# Altium schematic sheet Forward Active Supply.SchDoc
size A
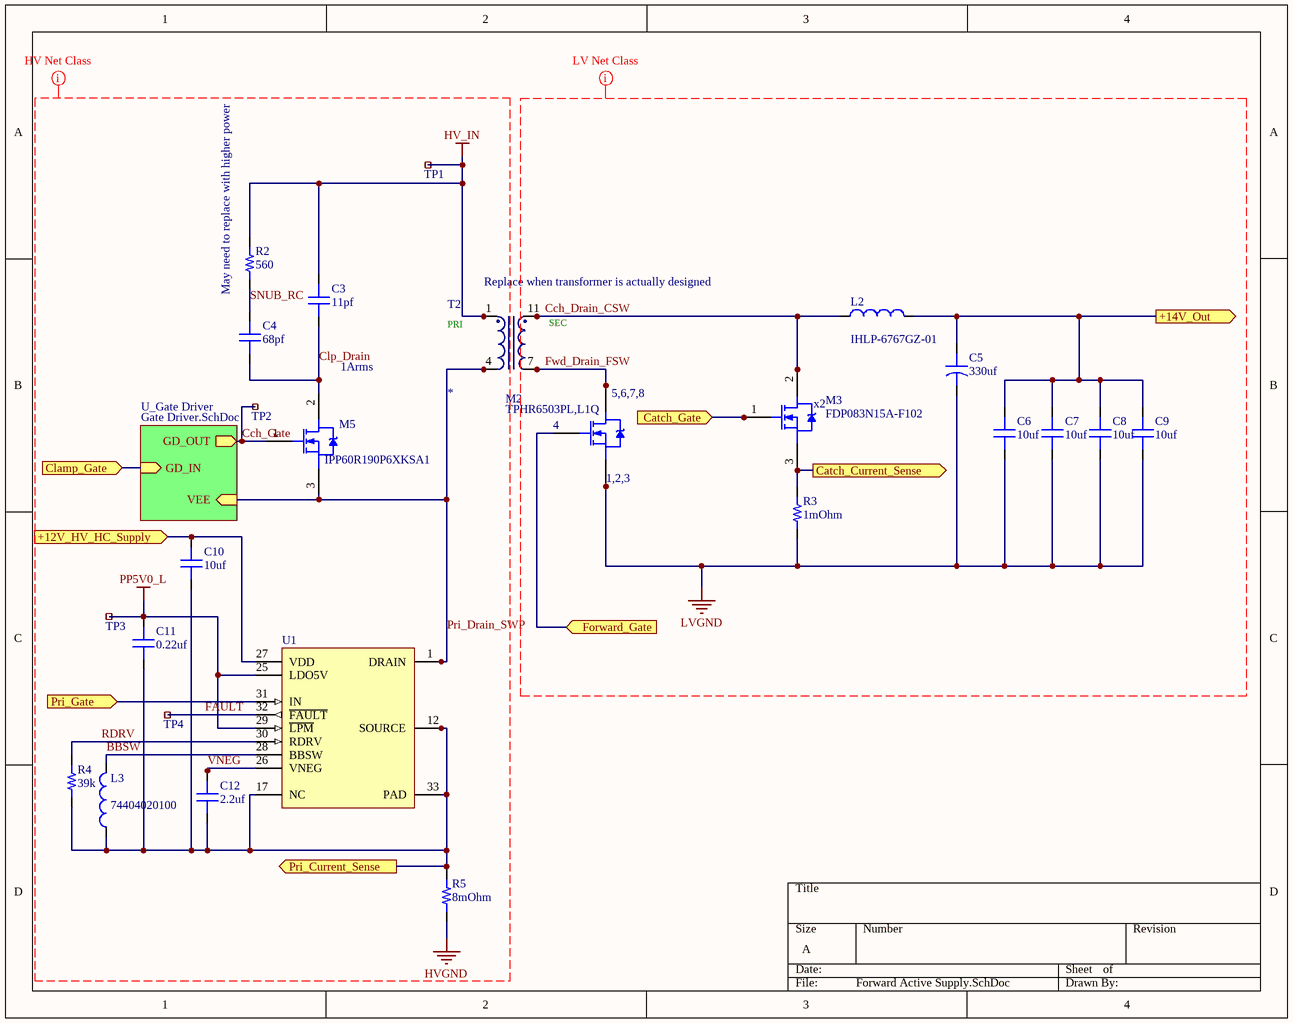
[diagram p0: Forward Active Supply.SchDoc]

## Parts
C3  value 11pf  [CAP 0805/2012]  (hidden comment: Capacitor MLCC 11pf 250V CAP 0805/2012)
C4  value 68pf  [CAP 0805/2012]  (hidden comment: Capacitor MLCC 68pf 200V CAP 0805/2012)
C5  value 330uf  [CAP ALUM 8.3MM]  (hidden comment: Capacitor Aluminum Hybrid Radial 330uf 25V CAP EL 8.3)
C6  value 10uf  [CAP 1206/3216 - 1.8MM]  (hidden comment: Capacitor MLCC 10uf 25V CAP 1206/3216)
C7  value 10uf  [CAP 1206/3216 - 1.8MM]  (hidden comment: Capacitor MLCC 10uf 25V CAP 1206/3216)
C8  value 10uf  [CAP 1206/3216 - 1.8MM]  (hidden comment: Capacitor MLCC 10uf 25V CAP 1206/3216)
C9  value 10uf  [CAP 1206/3216 - 1.8MM]  (hidden comment: Capacitor MLCC 10uf 25V CAP 1206/3216)
C10  value 10uf  [CAP 0603/1608]  (hidden comment: Capacitor MLCC 10uf 16V CAP 0603/1608)
C11  value 0.22uf  [CAP 0603/1608]  (hidden comment: Capacitor MLCC 0.22uf 50V CAP 0603/1608)
C12  value 2.2uf  [CAP 0603/1608]  (hidden comment: Capacitor MLCC 2.2uf 25V CAP 0603/1608)
L2  MfrPartNo: IHLP-6767GZ-01  [IHLP-6767GZ]
L3  (no value)  [74404020100]
M2  MfrPartNo: TPHR6503PL,L1Q  [SOP Advance]  (hidden comment: Forward Mosfet)
M3  MfrPartNo: FDP083N15A-F102  [TO-220ABx2]  (hidden comment: Catch Mosfet x2)
M5  MfrPartNo: IPP60R190P6XKSA1  [IPP60R190P6]  (hidden comment: Clamp Transistor)
R2  value 560  [RES 1206/3216]  (hidden comment: RES 560 OHM 1% 1W 1206)
R3  value 1mOhm  [RES 2010/5025]  (hidden comment: RES 0.001 OHM 1% 1.5W 2010)
R4  value 39k  [RES 0603/1608]  (hidden comment: Resistor 39k 0603 1/10W 1%)
R5  value 8mOhm  [RES 1206/3216]  (hidden comment: RES 0.008 OHM 1% 1W 1206)
T2  (no value)  [B66359]
TP1  RCU-0C  [5029]  (value not drawn)
TP2  RCU-0C  [5029]  (value not drawn)
TP3  RCU-0C  [5029]  (value not drawn)
TP4  RCU-0C  [5029]  (value not drawn)
U1  (no value)  [RWH0032A]

## Sub-sheets
U_Gate Driver = Gate Driver.SchDoc: GD_IN (in), VEE (in), GD_OUT (out)

## Ports
+12V_HV_HC_Supply (in), +14V_Out (out), Catch_Current_Sense (out), Catch_Gate (in), Clamp_Gate (in), Forward_Gate (in), Pri_Current_Sense (out), Pri_Gate (in)

## Nets
HV_IN: C3.2 R2.2 T2.1 T2.2 T2.3 TP1.1
HVGND: R5.1
LVGND: C5.2 C6.1 C7.1 C8.1 C9.1 M2.1(S) M2.2(S) M2.3(S) R3.1
PP5V0_L: C11.2 TP3.1 U1.25(LDO5V) U1.29(~{LPM})
+12V_HV_HC_Supply: C10.2 U1.27(VDD) ; port +12V_HV_HC_Supply
+14V_Out: C5.1 C6.2 C7.2 C8.2 C9.2 L2.2 ; port +14V_Out
BBSW: L3.2 U1.28(BBSW)
Catch_Current_Sense: M3.3(S) M3.6(S) R3.2 ; port Catch_Current_Sense
Catch_Gate: M3.1(G) M3.4(G) ; port Catch_Gate
Cch_Drain_CSW: L2.1 M3.2(D) M3.5(D) T2.11 T2.12 T2.13
Cch_Gate: M5.1(G) TP2.1 ; sheet U_Gate Driver/GD_OUT
Clamp_Gate: port Clamp_Gate, sheet U_Gate Driver/GD_IN
Clp_Drain: C3.1 C4.1 M5.2(D)
FAULT: TP4.1 U1.32(~{FAULT})
Forward_Gate: M2.4(G) ; port Forward_Gate
Fwd_Drain_FSW: M2.5(D) M2.6(D) M2.7(D) M2.8(D) T2.7 T2.8 T2.9 T2.10
Pri_Current_Sense: C10.1 C11.1 C12.2 L3.1 R4.1 R5.2 U1.12(SOURCE) U1.13(SOURCE) U1.14(SOURCE) U1.15(SOURCE) U1.16(SOURCE) U1.17(NC) U1.18(SOURCE) U1.19(SOURCE) U1.20(SOURCE) U1.21(SOURCE) U1.22(SOURCE) U1.23(SOURCE) U1.24(SOURCE) U1.33(PAD) ; port Pri_Current_Sense
Pri_Drain_SWP: M5.3(S) T2.4 T2.5 T2.6 U1.1(DRAIN) U1.2(DRAIN) U1.3(DRAIN) U1.4(DRAIN) U1.5(DRAIN) U1.6(DRAIN) U1.7(DRAIN) U1.8(DRAIN) U1.9(DRAIN) U1.10(DRAIN) U1.11(DRAIN) ; sheet U_Gate Driver/VEE
Pri_Gate: U1.31(IN) ; port Pri_Gate
RDRV: R4.2 U1.30(RDRV)
SNUB_RC: C4.2 R2.1
VNEG: C12.1 U1.26(VNEG)

## Layout directives
net class HV: BBSW, Cch_Gate, Clp_Drain, FAULT, HV_IN, HVGND, PP5V0_L, Pri_Drain_SWP, RDRV, SNUB_RC, VNEG
net class LV: Cch_Drain_CSW, Fwd_Drain_FSW, LVGND

## Notes on the sheet
- (near R2) May need to replace with higher power
- (near T2) Replace when transformer is actually designed
- 1Arms
- (in symbol 3) PRI; SEC
- (in symbol 18) 5,6,7,8; 1,2,3
- (in symbol 22) x2

## Library data of the parts
C3 = 1086: Manufacturer_id: 1; idCapacitor: 1086; Name: Cap_11pf_200V_CAP 0805/2012; Dielectric: Ceramic; Tolerance: 2%; Created_By: Nick Mah; Drawer_id: 1; Voltage_Rating: 250V; Package: CAP 0805/2012; ComponentLink1Description: Datasheet
C4 = 1085: Manufacturer_id: 1; idCapacitor: 1085; Name: Cap_68pf_200V_CAP 0805/2012; Dielectric: Ceramic; Tolerance: 5%; Created_By: Nick Mah; Drawer_id: 1; Voltage_Rating: 200V; Package: CAP 0805/2012; ComponentLink1Description: Datasheet
C5 = 1087: Null; Manufacturer_id: 1; MfrPartNo: EEH-ZA1E221P; idCapacitor: 1087; Name: Cap_330uf_25V_CAP EL 8.3; Tolerance: 20%; ESR: 0.027; Created_By: Jason Zhou; Supplier 1: Digi-Key; Supplier Part Number 1: P15437CT-ND; Drawer_id: 1; Voltage_Rating: 25V; Dielectric: Hybrid; Package: EL 8.3; Link: https://www.digikey.com/product-detail/en/panasonic-electronic-components/EEH-ZA1E221P/P15437CT-ND/3088149; ComponentLink1Description: Datasheet; Created_Date: 4/10/2019; ComponentLink1URL: https://industrial.panasonic.com/cdbs/www-data/pdf/RDD0000/ABA0000C1221.pdf; Updated_By: Jason Zhou; Updated_Date: 4/22/2019
C6-C9 = 1088: Manufacturer_id: 1; MfrPartNo: C3216X7R1E106K160AB; idCapacitor: 1088; Name: Cap_10uf_25V_CAP 1206/3216; Dielectric: Ceramic; Tolerance: 10%; Created_By: Jason Zhou; Drawer_id: 1; Voltage_Rating: 25V; Package: CAP 1206/3216; Link: https://www.digikey.com/product-detail/en/tdk-corporation/C3216X7R1E106K160AB/445-7705-1-ND/2733777; ComponentLink1Description: Datasheet; Created_Date: 4/10/2019; Supplier 1: Digi-Key; Supplier Part Number 1: 445-7705-1-ND; ComponentLink1URL: https://product.tdk.com/info/en/catalog/datasheets/mlcc_commercial_general_en.pdf
C10 = 235: Manufacturer_id: 1; idCapacitor: 235; Name: Cap_10uf_16V_CAP 0603/1608; Dielectric: Ceramic; Created_By: Nick Mah; Drawer_id: 1; Voltage_Rating: 16V; Package: CAP 0603/1608; Created_Date: 10/20/2018
C11 = 945: Manufacturer_id: 1; idCapacitor: 945; Name: Cap_0.22uf_50V_CAP 0603/1608; Dielectric: Ceramic; Created_By: Nick Mah; Drawer_id: 1; Voltage_Rating: 50V; Package: CAP 0603/1608; Created_Date: 10/20/2018
C12 = 591: Manufacturer_id: 1; idCapacitor: 591; Name: Cap_2.2uf_25V_CAP 0603/1608; Dielectric: Ceramic; Created_By: Nick Mah; Drawer_id: 1; Voltage_Rating: 25V; Package: CAP 0603/1608; Created_Date: 10/20/2018
L2 = 8: 1.5µH Shielded Molded Inductor 42A 1.88mOhm Max Nonstandard; Manufacturer_id: 1; idInductor: 8; Value: 1.5uH; Tolerance: 20%; Created_By: Jason Zhou; Drawer_id: 1; Name: IHLP-6767GZ-01; Current_Rating: 42A; DC_Resistance: 1.88mOhm; Package: Nonstandard; Link: https://www.digikey.com/product-detail/en/vishay-dale/IHLP6767GZER1R5M01/541-1251-1-ND/2025141; ComponentLink1Description: Datasheet; ComponentLink1URL: http://www.vishay.com/docs/34000/ihlp-6767gz-01.pdf; Supplier1: Digi-Key; Supplier1PartNo: 541-1251-1-ND; Created_Date: 4/22/2019
L3 = 7: 10µH Shielded Wirewound Inductor 500mA 850mOhm Nonstandard; Manufacturer_id: 1; idInductor: 7; Value: 10uH; Current_Rating: 0.5A; Tolerance: 20%; SRF: 39MHz; Created_By: Jason Zhou; MfrPartNo: 74404020100; Drawer_id: 1; Name: 74404020100; DC_Resistance: 850mOhm; Package: Nonstandard; Link: https://www.digikey.com/product-detail/en/wurth-electronics-inc/74404020100/732-10745-1-ND/6598179; ComponentLink1Description: Datasheet; ComponentLink1URL: https://katalog.we-online.de/pbs/datasheet/74404020100.pdf; Supplier1: Digi-Key; Supplier1PartNo: 732-10745-1-ND; Created_Date: 4/18/2019
M2 = 18: N-Channel 30V 150A (Tc) 960mW (Ta), 170W (Tc) Surface Mount 8-SOP Advance (5x5); Manufacturer_id: 1; idFETs: 18; Value: N_Channel; Rds_On: 65mOhm; Vgs(typ): 10V; Vgs(Max): 20V; Created_By: Nick Mah; Drawer_id: 1; Name: TPHR6503PL; Vdss: 30V; Num_Circuits: 1; Id: 150A; Power(Max): 170W; Package: SOP Advance; Link: https://www.digikey.com/product-detail/en/toshiba-semiconductor-and-storage/TPHR6503PLL1Q/TPHR6503PLL1QCT-ND/6099957; ComponentLink1Description: Datasheet; ComponentLink1URL: https://toshiba.semicon-storage.com/info/docget.jsp?did=35760&prodName=TPHR6503PL; Supplier1: Digi-Key; Supplier1PartNo: TPHR6503PLL1QCT-ND
M3 = 22: N-Channel 150V 83A (Tc) 294W (Tc) Through Hole TO-220-3; Manufacturer_id: 1; idFETs: 22; Value: N_Channel x2; Rds_On: 8.3mOhm; Vgs(typ): 10V; Vgs(Max): 20V; Drawer_id: 1; Name: FDP083N15Ax2; Vdss: 150V; Num_Circuits: 1; Id: 83A; Power(Max): 294W; Package: TO-220ABx2; Link: https://www.digikey.com/product-detail/en/on-semiconductor/FDP083N15A-F102/FDP083N15A-F102-ND/3137187; ComponentLink1Description: Datasheet; ComponentLink1URL: https://www.onsemi.com/pub/Collateral/FDP083N15A-D.pdf; Supplier1: Digi-Key; Supplier1PartNo: FDP083N15A-F102-ND
M5 = 16: N-Channel 600V 20.2A (Tc) 151W (Tc) Through Hole PG-TO220-3; Manufacturer_id: 1; idFETs: 16; Value: N_Channel; Id: 20.2; Rds_On: 190mOhm; Vgs(typ): 10V; Vgs(Max): 20V; Created_By: Nick Mah; Drawer_id: 1; Name: IPP60R190P6; Vdss: 600V; Num_Circuits: 1; Power(Max): 151W; Package: TO-220; Link: https://www.digikey.com/products/en?keywords=IPP60R190P6; ComponentLink1Description: Datasheet; ComponentLink1URL: https://www.infineon.com/dgdl/DS_IPP60R190P6_2_0_Approved.pdf?folderId=db3a3043156fd5730115c736bcc70ff2&fileId=db3a30433f2e70c5013f37a818ba23e7; Supplier1: Digi-Key; Supplier1PartNo: IPP60R190P6XKSA1-ND
R2 = 2712: Manufacturer_id: 1; idResistor: 2712; Name: Res_560_1206_1W_5%; Tolerance: 5%; Created_By: Nick Mah; Supplier 1: Digi-Key; Supplier Part Number 1: Digi-Key; Drawer_id: 1; Power: 1W; Package: 1206; ComponentLink1Description: Datasheet
R3 = 2713: 1 mOhms ±1% 1.5W Chip Resistor 2010 (5025 Metric) Current Sense, Moisture Resistant Metal Foil; Manufacturer_id: 1; MfrPartNo: TLR2H15DR001FTDG; idResistor: 2713; Name: Res_0.001_2010_1.5W_1%; Created_By: Nick Mah; Supplier 1: Digi-Key; Supplier Part Number 1: A138745CT-ND; Drawer_id: 1; Tolerance: 1%; Power: 1.5W; Package: 2010; Link: https://www.digikey.com/product-detail/en/te-connectivity-passive-product/TLR2H15DR001FTDG/A138745CT-ND/9372146; ComponentLink1Description: Datasheet; ComponentLink1URL: https://www.te.com/commerce/DocumentDelivery/DDEController?Action=srchrtrv&DocNm=1773449-3&DocType=DS&DocLang=English
R4 = 327: Manufacturer_id: 1; idResistor: 327; Name: Res_39k_0603_1/10W_1%; Created_By: Nick Mah; Supplier 1: Digi-Key; Drawer_id: 1; Tolerance: 1%; Power: 1/10W; Package: 0603; ComponentLink1Description: Datasheet; Created_Date: 2018-10-20
R5 = 2710: 8 mOhms ±1% 1W Chip Resistor 1206 (3216 Metric) Automotive AEC-Q200, Current Sense Thick Film; Manufacturer_id: 1; idResistor: 2710; Name: PMR18EZPFU8L00; Created_By: Nick Mah; Supplier 1: Digi-Key; Supplier Part Number 1: RHM.008ALCT-ND; Drawer_id: 1; Tolerance: 1%; Power: 1W; Package: 1206; MfrPartNo: PMR18EZPFU8L00; Link: https://www.digikey.com/product-detail/en/rohm-semiconductor/PMR18EZPFU8L00/RHM.008ALCT-ND/2094241; ComponentLink1Description: Datasheet; ComponentLink1URL: https://www.rohm.com/datasheet/PMR18EZPFV/pmr-e
T2 = 3: Manufacturer_id: 1; idTransformer: 3; Name: 500W DC-DC Main Trfrmr; Value: 200uH x:x; Voltage_Primary: 200-450VDC; Voltage_Secondary: 45-95VDC; MfrPartNo: *; Drawer_id: 1
TP1-TP4 = 28: Test point; Manufacturer_id: 1; idConn: 28; Value: CONN; Created_By: Jason Zhou; Drawer_id: 1; Name: 5029; Num_Contacts: 1; Num_Rows: 1; Package: 5029; MfrPartNo: 5029; Link: https://www.digikey.com/product-detail/en/keystone-electronics/5029/36-5029CT-ND/5980631; ComponentLink1Description: Datasheet; ComponentLink1URL: file:///C:/Users/Jason%20Zhou/Downloads/5029.PDF; Supplier1: Digi-Key; Supplier1PartNo: 36-5029CT-ND; Created_Date: 4/26/2019
U1 = 19: N-Channel 600-V 50mOhm GaN with integrated driver and protection; Manufacturer_id: 1; MfrPartNo: XLMG3410R050RWHT; idFETs: 19; Value: N_Channel; Vdss: 600V; Id: 12A; Created_By: Jason Zhou; Drawer_id: 1; Name: LMG3410R050; Num_Circuits: 1; Rds_On: 50mOhm; Package: VQFN RWH; Link: http://www.ti.com/product/LMG3410R050?qgpn=lmg3410r050; ComponentLink1Description: Datasheet; ComponentLink1URL: http://www.ti.com/lit/ds/symlink/lmg3410r050.pdf; Created_Date: 4/18/2019